# EAGLE schematic RackSide (EAGLE 7.7.0)
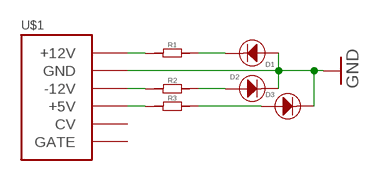
[diagram p0: schematic, sheet 1]

## Parts
D1  LED  [LED0603]
D2  LED  [LED0603]
D3  LED  [LED0603]
R1  R-0603  [R0603]
R2  R-0603  [R0603]
R3  R-0603  [R0603]
U$1  POWERSMT  [2X08_SMT_HEADER]

## Nets
GND: D1.+ D2.- D3.- U$1.3(GND) U$1.4(GND) U$1.5(GND) U$1.6(GND) U$1.7(GND) U$1.8(GND)
N$1: R1.1 U$1.9(+12V) U$1.10(+12V)
N$2: R2.1 U$1.1(-12V) U$1.2(-12V)
N$3: R3.1 U$1.11(+5V) U$1.12(+5V)
N$4: D1.- R1.2
N$5: D2.+ R2.2
N$6: D3.+ R3.2
Unconnected: U$1.13(CV) U$1.14(CV) U$1.15(GATE) U$1.16(GATE)

## Library data of the parts
D1-D3 = EurorackModularParts:LED*: LED
R1-R3 = OPL:R*
U$1 = EurorackModularParts:POWER

## Net classes
0 default: width 0.5 mm